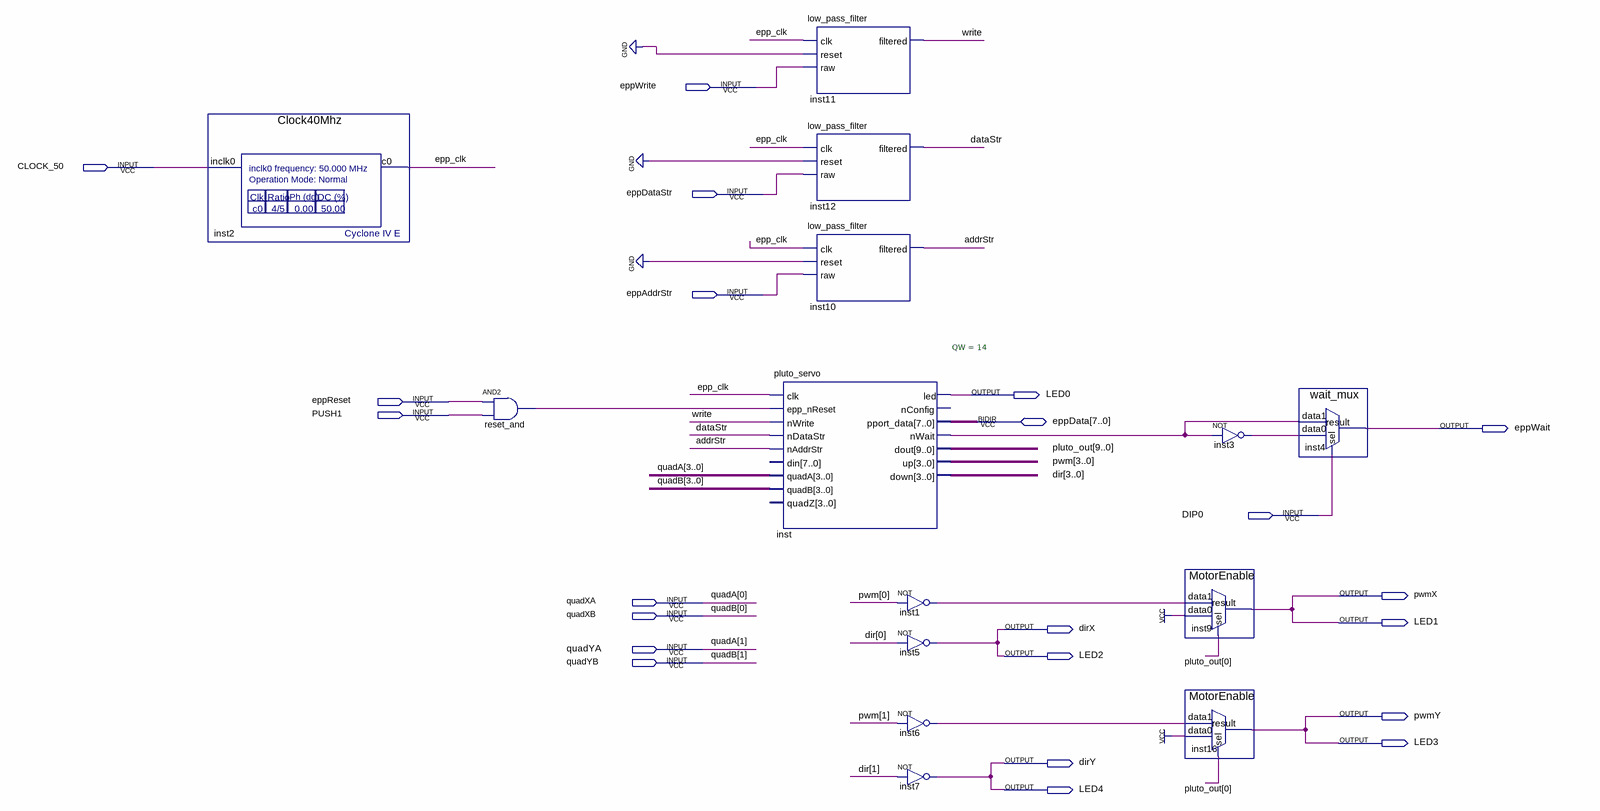
[diagram p0: schematic sheet]
// Quartus schematic PlutoP.bdf as structural Verilog: 14 symbols, 22 pins
module PlutoP (
  input  eppWrite,
  input  CLOCK_50,
  input  eppDataStr,
  input  eppAddrStr,
  input  eppReset,
  input  PUSH1,
  input  DIP0,
  input  quadXA,
  input  quadXB,
  input  quadYA,
  input  quadYB,
  inout  [7:0] eppData,
  output LED0,
  output eppWait,
  output pwmX,
  output LED1,
  output dirX,
  output LED2,
  output pwmY,
  output LED3,
  output dirY,
  output LED4
);

  wire addrStr, dataStr, epp_clk, inst1_out, inst3_out, inst6_out, inst_nwait, reset_and_out, write;
  wire [3:0] dir, pwm;
  wire [3:2] quadA, quadB;
  wire [9:0] pluto_out;

  Clock40Mhz inst2 (.inclk0(CLOCK_50), .c0(epp_clk));
  and reset_and (reset_and_out, eppReset, PUSH1);
  low_pass_filter inst11 (.clk(epp_clk), .reset(1'b0), .raw(eppWrite), .filtered(write));
  low_pass_filter inst12 (.clk(epp_clk), .reset(1'b0), .raw(eppDataStr), .filtered(dataStr));
  low_pass_filter inst10 (.clk(epp_clk), .reset(1'b0), .raw(eppAddrStr), .filtered(addrStr));
  pluto_servo #(.QW(14)) inst (
    .clk(epp_clk), .epp_nReset(reset_and_out), .nWrite(write), .nDataStr(dataStr), .nAddrStr(addrStr),
    .quadA({quadA, quadYA, quadXA}), .quadB({quadB, quadYB, quadXB}), .led(LED0), .nWait(inst_nwait),
    .dout(pluto_out), .up(pwm), .down(dir), .pport_data(eppData));  // open: din, quadZ, nConfig
  not inst1 (inst1_out, pwm[0]);
  not inst5 (dirX, dir[0]);
  not inst6 (inst6_out, pwm[1]);
  not inst7 (dirY, dir[1]);
  MotorEnable inst9 (.data1(inst1_out), .data0(1'b1), .sel(pluto_out[0]), .result(LED1));
  MotorEnable inst16 (.data1(inst6_out), .data0(1'b1), .sel(pluto_out[0]), .result(LED3));
  not inst3 (inst3_out, inst_nwait);
  wait_mux inst4 (.data1(inst_nwait), .data0(inst3_out), .sel(DIP0), .result(eppWait));

  assign LED2 = dirX;
  assign LED4 = dirY;
  assign pwmX = LED1;
  assign pwmY = LED3;

  // Other names for the same wires on the sheet: quadA[1:0] = {quadYA, quadXA}; quadB[1:0] = {quadYB, quadXB}
endmodule
